# Altium schematic sheet AUDIO.schdoc: =
size A4; Symbol: Sheet-Symbol_A4; Company: 嘉立创EDA; Version: V1.0; Page Size: A4; @Project Name: RK3568B2地瓜派; @Page Count: 27; @Update Date: 2025-09-15; @Create Date: 2025-09-11; @Schematic Name: Schematic1; @Page No: 24; @Page Name: AUDIO; Device: Sheet-Symbol_A4; Border: 1; Title Block Position: 3; Width: 1170; Height: 825; Region Start: 1; X Region Count: 6; Y Region Count: 4; Blade Width: 10; @Board Name: Board1; @Create Time: 22:30:13; @Update Time: 13:47:58; Organization: ORGANIZATION; Address1: ADDRESS 1; Address2: ADDRESS 2; Address3: ADDRESS 3; Address4: ADDRESS 4; SheetNumber: 24; SheetTotal: 28
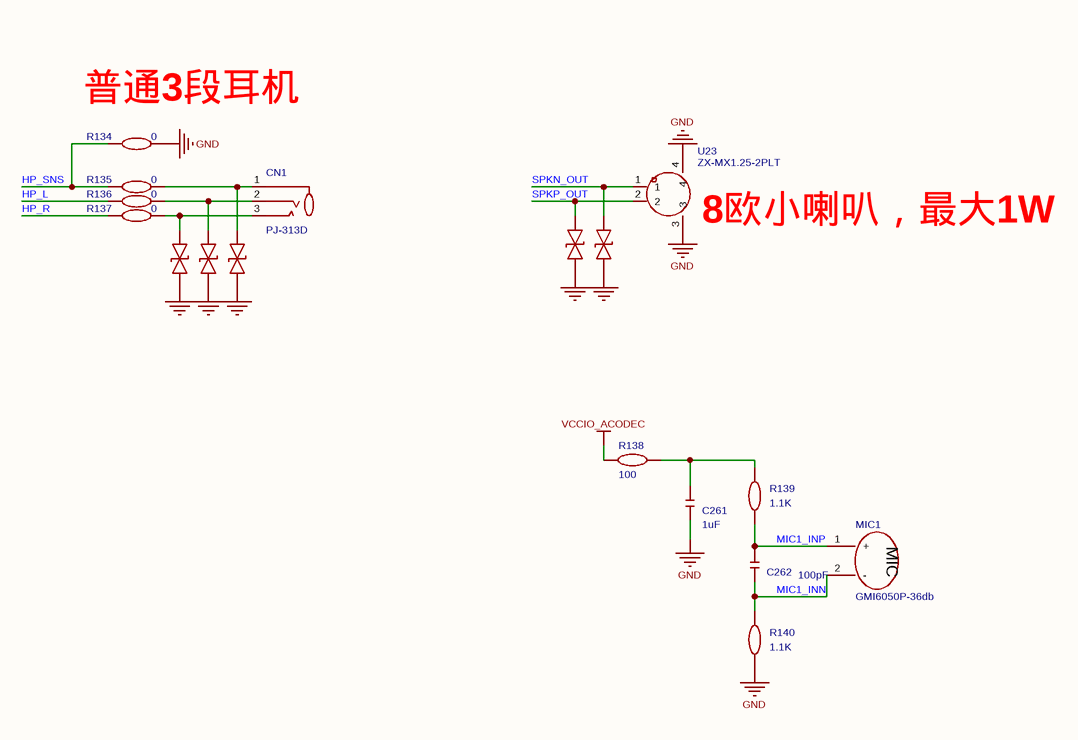
[diagram p0: AUDIO.schdoc]

## Parts
C261  1uF  [MYC0402]
C262  100pF  [MYC0402]
CN1  PJ-313D  [AUDIO-SMD_PJ-313D-2]
MIC1  GMI6050P-36db  [MIC-TH_BD6.0-P1.90-D0.4-L-FD_GMI6050P-2CXXDB]
R134  0  [R0402]
R135  0  [R0402]
R136  0  [R0402]
R137  0  [R0402]
R138  100  [R0402]
R139  1.1K  [R0402]
R140  1.1K  [R0402]
U23  ZX-MX1.25-2PLT  [CONN-SMD_2P-P1.25-MX1.25-2P-LT]
U24  ESD5341N  [DFN1006-2L-BI]  (value not drawn)
U25  ESD5341N  [DFN1006-2L-BI]  (value not drawn)
U26  ESD5341N  [DFN1006-2L-BI]  (value not drawn)
U27  ESD5341N  [DFN1006-2L-BI]  (value not drawn)
U28  ESD5341N  [DFN1006-2L-BI]  (value not drawn)

## Nets
GND: C261.1 R134.2 R140.1 U23.3 U23.4 U24.1 U25.1 U26.1 U27.1 U28.1
VCCIO_ACODEC: R138.2
HP_L: R136.1
HP_R: R137.1
HP_SNS: R134.1 R135.1
MIC1_INN: C262.1 MIC1.2(-) R140.2
MIC1_INP: C262.2 MIC1.1(+) R139.1
SPKN_OUT: U23.1 U25.2
SPKP_OUT: U23.2 U24.2
NetC261_2: C261.2 R138.1 R139.2
NetCN1_1: CN1.1 R135.2 U28.2
NetCN1_2: CN1.2 R136.2 U27.2
NetCN1_3: CN1.3 R137.2 U26.2

## Notes on the sheet
- (near R134) 普通3段耳机
- 8欧小喇叭，最大1W
- Drawn By :
- Checked By :
- Approved By :
- SheetNumber
- SheetTotal
- Revision :
- Time :
- Size :
- Date :
- A4
- DocumentName :
- Project :
- (in symbol GMI6050P-36db) MIC

## Library data of the parts
C261 C262 = MYC0402: C0402电容; Symbol: MY_C0201; AddInBom: yes; Device: MYC0402; ConvertToPcb: yes; FootprintName: MYC0402
  C261: Value: 1uF
  C262: Value: 100pF
CN1 = PJ-313D_C668608: 连接器类型:3.5mm耳机座;额定电流:500mA;额定电压:30V;触头材质:铜;触头镀层:银;工作温度范围:-30℃~+70℃;; Manufacturer: SHOU HAN(首韩); AddInBom: yes; ModelId: 4c414bff0d4f41fcb665cbf6b08ddc6c; ModelTransform: 334.645,551.18,0,0,0,0,0,19.685,-19.685; Current Rating (Max): 500mA; Voltage Rating (Max): 30V; Symbol: PJ-313D_C668608; Device: PJ-313D_C668608; LCSC Part Name: 3.5mm耳机座; SupplierPart: C668608; ManufacturerPart: PJ-313D; Supplier Footprint: SMD; JLCPCB Part Class: 扩展库; Datasheet: https://atta.szlcsc.com/upload/public/pdf/source/20200618/C668608_AB2020DBBA26E8897834D328F2FA3C40.pdf; Supplier: LCSC; ConvertToPcb: yes; FootprintName: AUDIO-SMD_PJ-313D-2; ModelName: AUDIO-SMD_PJ-313D-2; Connector Type: 3.5mm耳机座; Contact Material: 铜; Contact Plating: 银; Operating Temperature Range: -30℃~+70℃
MIC1 = GMI6050P-36db: Manufacturer: INGHAi(赢海); AddInBom: yes; ModelId: 13bff40b06b543799f1cf39aeb3f973a聨0819f05c4eef4c71ace90d822a990e87; ModelTransform: 236.22,235.915,0,0,0,0,0,-0.003,-118.11; Symbol: GMI6050P-36DB; Device: GMI6050P-36db; LCSC Part Name: 全指向φ6.0*5.0mm 1.5V-10V 灵敏度-36db 低阻抗 针脚; SupplierPart: C233939; ManufacturerPart: GMI6050P-36db; Supplier Footprint: 插件,D=6mm; JLCPCB Part Class: Extended Part; Datasheet: https://atta.szlcsc.com/upload/public/pdf/source/20180613/C233951_CF3F103FE3546E5F8FCD1BC0597FF08F.pdf; Supplier: LCSC; ConvertToPcb: yes; FootprintName: MIC-TH_BD6.0-P1.90-D0.4-L-FD_GMI6050P-2CXXDB; ModelName: MIC-TH_BD6.0-P1.90-D0.4-L-FD_GMI6050P-2CXXDB
R134 R138-R140 = Res_0402: Symbol: 电阻; 3D Model: 671aefced39d4c318694bba8bd8efd39; 3D Model Transform: 39.37,19.685,0,0,0,0,0,0.0005,0; ConvertToPcb: yes; ModelName: R0402_L1.0-W0.5-H0.5; Device: Res_0402; Supplier Footprint: 0402; AddInBom: yes; FootprintName: R0402
  R134: Value: 0
  R138: Value: 100
  R139 R140: Value: 1.1K
R135-R137 = Res_0402: Symbol: 电阻; ConvertToPcb: yes; ModelId: 671aefced39d4c318694bba8bd8efd39; ModelName: R0402_L1.0-W0.5-H0.5; ModelTransform: 39.37,19.685,0,0,0,0,0,0.0005,0; Value: 0; Device: Res_0402; AddInBom: yes; Supplier Footprint: 0402; FootprintName: R0402
U23 = ZX-MX1.25-2PLT: 插针结构:1x2P;间距:1.25mm;安装方式:立贴;参考系列:PicoBlade(MX 1.25);总PIN数:2P;排数:1;每排PIN数:2;行距:-;额定电流:1A;触头材质:黄铜;触头镀层:锡;工作温度:-25℃~+85℃;; Manufacturer: Megastar(兆星); AddInBom: yes; ModelId: 48bd7d836b6f42088ab475ec0682dcba聨0819f05c4eef4c71ace90d822a990e87; ModelTransform: 289.37,165.354,0,180,0,0,0,-15,0; Pins Structure: 1x2P; Pitch: 1.25mm; Number of PINs Per Row: 2; Current Rating: 1A; Voltage Rating: 125V; Plastic Material: LCP; Supplementary Features: 辅助焊脚; Z-Height of the Board: 4.7mm; X-Length of Bottom Edge on Board (Spacing Line): 7.5mm; Y-Width of Bottom Edge on Board: 4.3mm; Symbol: ZX-MX1.25-2PLT; Device: ZX-MX1.25-2PLT; LCSC Part Name: 1x2P 间距:1.25mm 立贴 系列:PicoBlade(MX 1.25); SupplierPart: C7430473; ManufacturerPart: ZX-MX1.25-2PLT; Supplier Footprint: SMD,P=1.25mm; JLCPCB Part Class: Extended Part; Datasheet: https://item.szlcsc.com/datasheet/ZX-MX1.25-2PLT/8430342.html; Supplier: LCSC; ConvertToPcb: yes; FootprintName: CONN-SMD_2P-P1.25-MX1.25-2P-LT; ModelName: CONN-SMD_2P-P1.25-MX1.25-2P-LT; Mounting Type: 立贴; Reference Series: PicoBlade(MX 1.25); Number of Pins: 2P; Number of Rows: 1; Row Spacing: -; Contact Material: 黄铜; Contact Plating: 锡; Operating Temperature: -25℃~+85℃; Flame Retardant Rating: -; Color: 米色
U24 U25 = ESD5341N_C20612964: Manufacturer: KUU; 3D Model: 2bdbcca3b35b49c5a8ae725a08658930; 3D Model Transform: 40.1574,24.4094,0,0,0,0,0,0,0; AddInBom: yes; Symbol: ESD5341N_C20612964; Device: ESD5341N_C20612964; LCSC Part Name: ESD静电保护管; Supplier Part: C20612964; Manufacturer Part: ESD5341N; Supplier Footprint: DFN1006-2L; JLCPCB Part Class: 扩展库; Datasheet: https://atta.szlcsc.com/upload/public/pdf/source/20240126/9EE8C033ACD76A81C21292FAA1DFE4C1.pdf; Supplier: LCSC; ConvertToPcb: yes; FootprintName: DFN1006-2L-BI; ModelName: DFN1006-2L-BI
U26-U28 = ESD5341N_C20612964: Manufacturer: KUU; AddInBom: yes; ModelId: 2bdbcca3b35b49c5a8ae725a08658930; ModelTransform: 40.1574,24.4094,0,0,0,0,0,0,0; Symbol: ESD5341N_C20612964; Device: ESD5341N_C20612964; LCSC Part Name: ESD静电保护管; SupplierPart: C20612964; ManufacturerPart: ESD5341N; Supplier Footprint: DFN1006-2L; JLCPCB Part Class: 扩展库; Datasheet: https://atta.szlcsc.com/upload/public/pdf/source/20240126/9EE8C033ACD76A81C21292FAA1DFE4C1.pdf; Supplier: LCSC; ConvertToPcb: yes; FootprintName: DFN1006-2L-BI; ModelName: DFN1006-2L-BI